# EAGLE design controller (EAGLE 6.5.0)
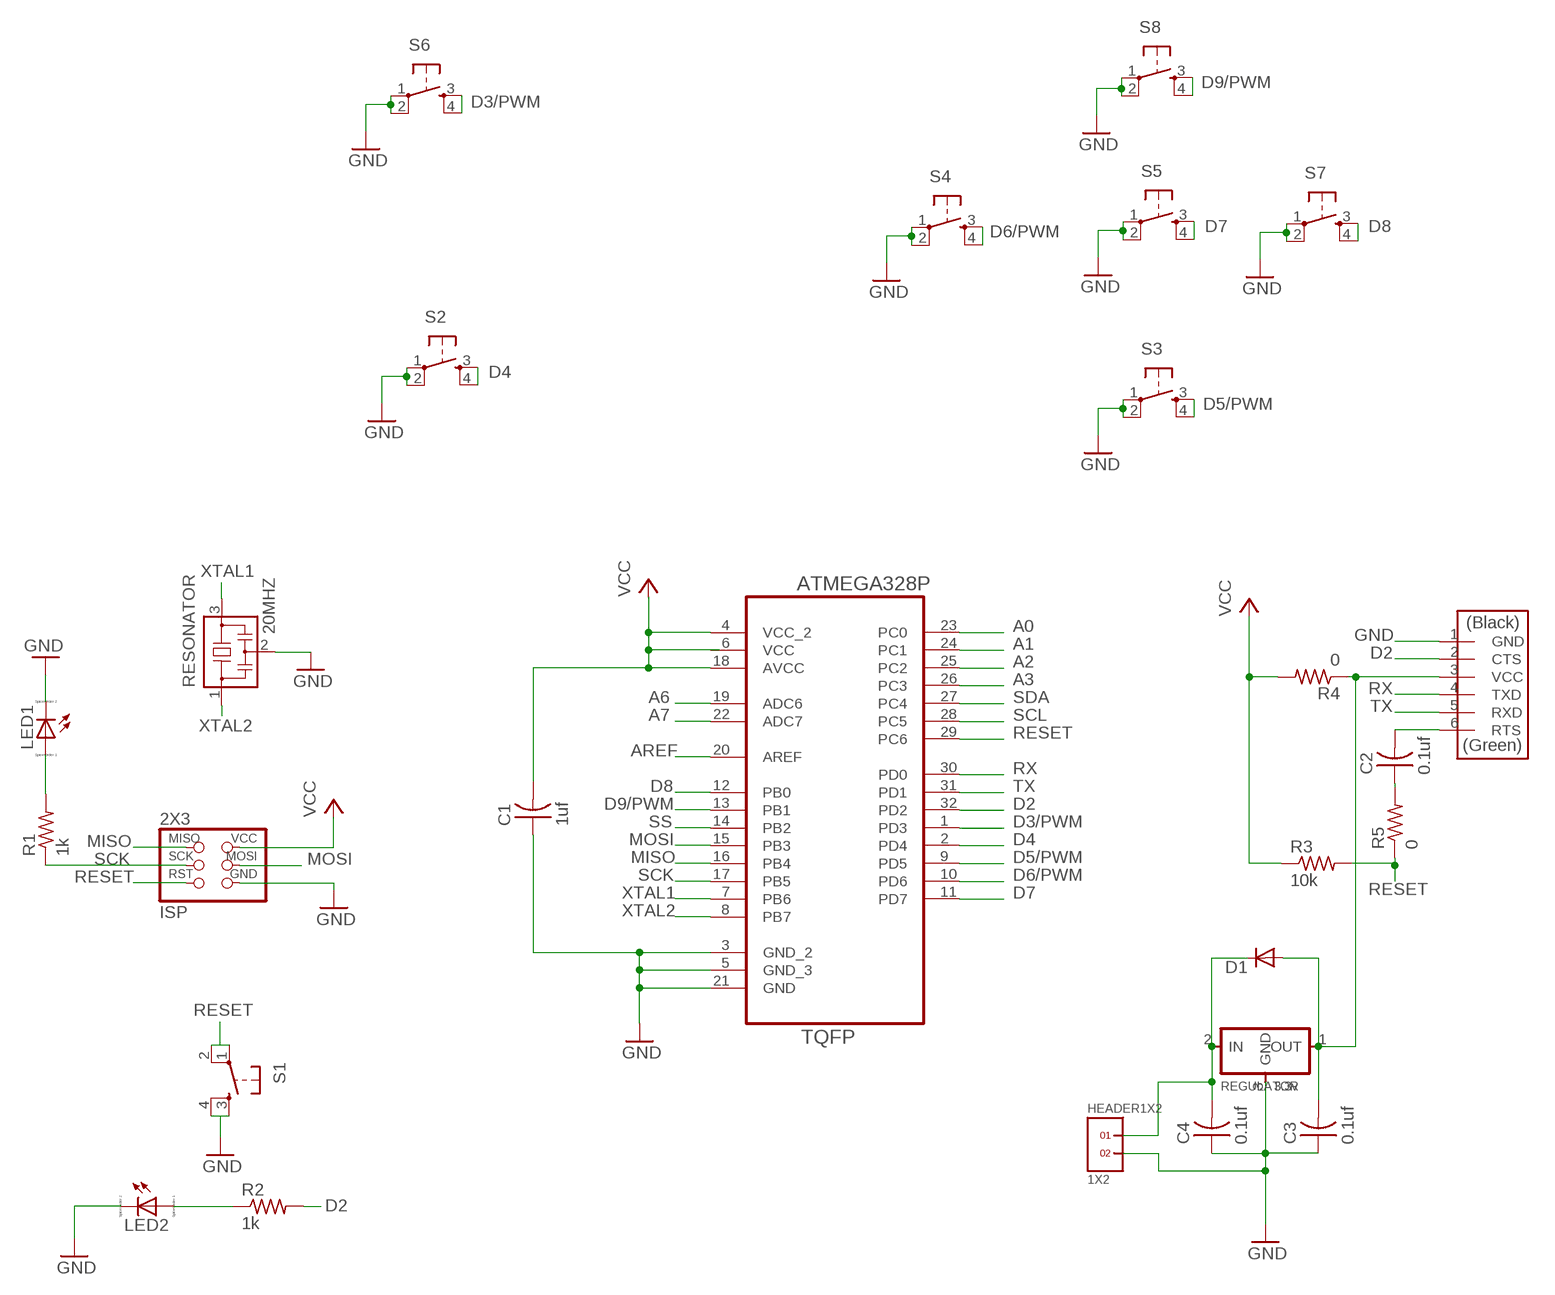
[diagram p0: schematic, sheet 1]

## Parts
2X3  ISP  AVRISPSMD  [2X03SMD]
C1  1uf  CAP-US1206  [C1206]
C2  0.1uf  CAP-US1206  [C1206]
C3  0.1uf  CAP-US1206  [C1206]
C4  0.1uf  CAP-US1206  [C1206]
D1  DIODESOD123  [SOD123]
FTDI  FTDI-SMD-HEADER  [1X06SMD]
HEADER1X2  1X2  [1X2]
LED1  LED_E  [LED_1206]
LED2  LED_E  [LED_1206]
R1  1k  RES-US1206  [R1206]
R2  1k  RES-US1206  [R1206]
R3  10k  RES-US1206  [R1206]
R4  0  RES-US1206  [R1206]
R5  0  RES-US1206  [R1206]
REGULATOR  3.3v  REGULATORSOT23  [SOT23]
RESONATOR  20MHZ  RESONATOR  [EFOBM]
S1  6MM_SWITCH6MM_SWITCH  [6MM_SWITCH]
S2  6MM_SWITCH6MM_SWITCH  [6MM_SWITCH]
S3  6MM_SWITCH6MM_SWITCH  [6MM_SWITCH]
S4  6MM_SWITCH6MM_SWITCH  [6MM_SWITCH]
S5  6MM_SWITCH6MM_SWITCH  [6MM_SWITCH]
S6  6MM_SWITCH6MM_SWITCH  [6MM_SWITCH]
S7  6MM_SWITCH6MM_SWITCH  [6MM_SWITCH]
S8  6MM_SWITCH6MM_SWITCH  [6MM_SWITCH]
U1  ATMEGA328P-AU  [QFP80P900X900X120-32N]

## Nets
A0: U1.23(PC0)
A1: U1.24(PC1)
A2: U1.25(PC2)
A3: U1.26(PC3)
A6: U1.19(ADC6)
A7: U1.22(ADC7)
AREF: U1.20(AREF)
D2: FTDI.2(CTS) R2.2 U1.32(PD2)
D3/PWM: S6.3(S) S6.4(S1) U1.1(PD3)
D4: S2.3(S) S2.4(S1) U1.2(PD4)
D5/PWM: S3.3(S) S3.4(S1) U1.9(PD5)
D6/PWM: S4.3(S) S4.4(S1) U1.10(PD6)
D7: S5.3(S) S5.4(S1) U1.11(PD7)
D8: S7.3(S) S7.4(S1) U1.12(PB0)
D9/PWM: S8.3(S) S8.4(S1) U1.13(PB1)
GND: 2X3.6(GND) C1.1 C3.1 C4.1 FTDI.1(GND) HEADER1X2.2 LED1.C LED2.C REGULATOR.3(GND) RESONATOR.2 S1.3(S) S1.4(S1) S2.1(P) S2.2(P1) S3.1(P) S3.2(P1) S4.1(P) S4.2(P1) S5.1(P) S5.2(P1) S6.1(P) S6.2(P1) S7.1(P) S7.2(P1) S8.1(P) S8.2(P1) U1.3(GND_2) U1.5(GND_3) U1.21(GND)
MISO: 2X3.1(MISO) U1.16(PB4)
MOSI: 2X3.4(MOSI) U1.15(PB3)
N$1: LED1.A R1.2
N$2: LED2.A R2.1
N$7: C2.1 R5.2
N$23: C4.2 D1.CATHODE(C) HEADER1X2.1 REGULATOR.2(IN)
N$29: C3.2 D1.ANODE(A) FTDI.3(VCC) R4.1 REGULATOR.1(OUT)
N$43: C2.2 FTDI.6(RTS)
RESET: 2X3.5(RST) R3.2 R5.1 S1.1(P) S1.2(P1) U1.29(PC6)
RX: FTDI.4(TXD) U1.30(PD0)
SCK: 2X3.3(SCK) R1.1 U1.17(PB5)
SCL: U1.28(PC5)
SDA: U1.27(PC4)
SS: U1.14(PB2)
TX: FTDI.5(RXD) U1.31(PD1)
VCC: 2X3.2(VCC) C1.2 R3.1 R4.2 U1.4(VCC_2) U1.18(AVCC)
XTAL1: RESONATOR.3 U1.7(PB6)
XTAL2: RESONATOR.1 U1.8(PB7)

## Power pins joined to a net without a drawn wire
VCC: U1.6(VCC)

## Library data of the parts
2X3 = fab:AVRISP
C1-C4 = fab:CAP-US
D1 = fab:DIODE: DIODE high speed (Philips)
FTDI = fab:FTDI-SMD-HEADER
HEADER1X2 = headers(2mm):1X2
LED1 LED2 = eagle-ltspice:LED_E: LED Source: http://www.osram.convergy.de Source: www.luxeon.com Source: www.kingbright.com; SPICEMODEL: NONE; SPICEPREFIX: D; SPICETYPE: diode
R1-R5 = fab:RES-US: Resistor (US Symbol) Variants with postfix FAB are widened to allow the routing of internal traces
REGULATOR = fab:REGULATOR
RESONATOR = fab:RESONATOR
S1-S8 = fab:6MM_SWITCH: OMRON SWITCH
U1 = fab:ATMEGA328P-AU; DESCRIPTION: 8-bit Microcontroller with In-System Programmable Flash; MPN: ATMEGA328P-AU; OC_FARNELL: 1715486; OC_NEWARK: 14R4631; PACKAGE: TQFP-32; SUPPLIER: Atmel

## Board
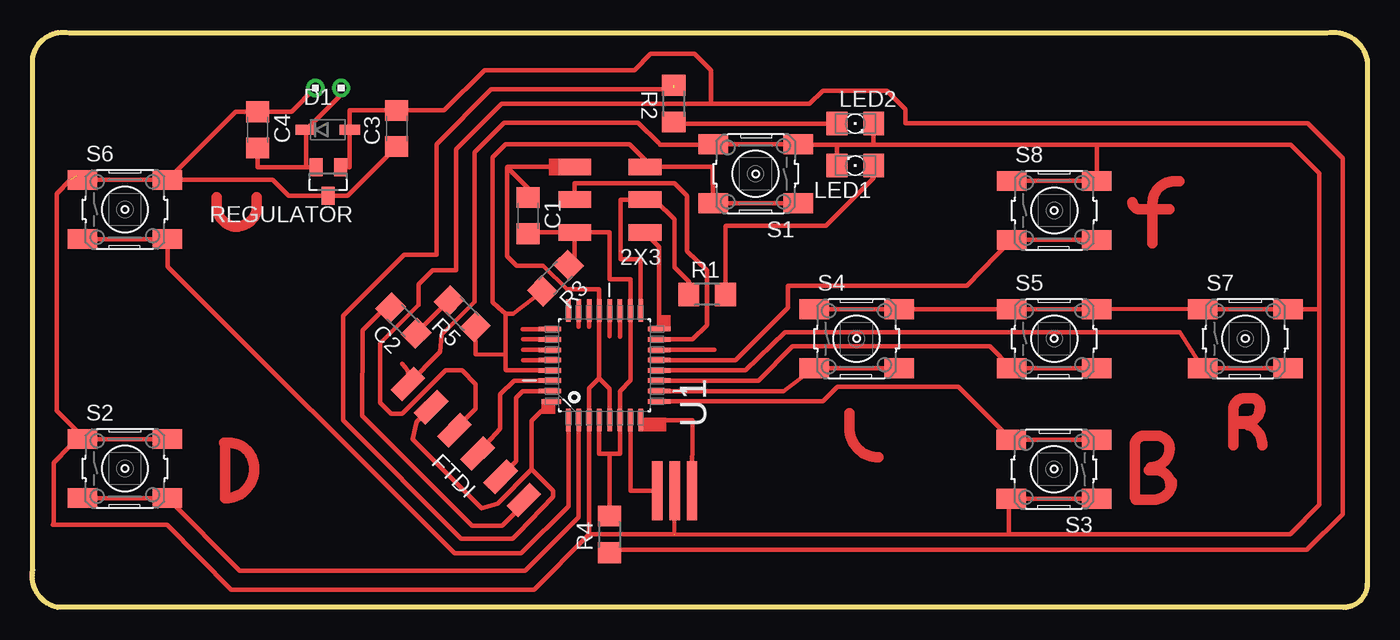
[diagram p1: board, top side]

Size 103.45 x 44.55 mm. Coordinates in mm from the lower left corner, seen from the top.
Outline: 101.62,0 1.96,0 arc-90 0.05,2.91 0.05,42.67 arc-90 2.88,44.5 100.33,44.5 arc-90 103.45,42.38 103.45,1.83 arc-90 101.62,0
Copper layers (1*16): Top 0.035mm / dielectric 1.5mm / Bottom 0.035mm
Design rules "default *": minimum track width 10mil, minimum drill 24mil, track to track 16mil, track to pad 16mil, pad to pad 16mil, via to via 16mil, smd to smd 16mil, copper to edge 40mil, drill to drill 8mil, minimum pad ring 10mil, minimum via ring 8mil, stop-mask expansion 4mil, vias tented up to drill 0mil, thermal gap 10mil

### Footprints (pad centres in the part's own frame; a part is rotated, then mirrored left to right if it is on the bottom)
2X03SMD = smd 2.54 x 1.27: 1 -2.54,2.54; 2 2.92,2.54; 3 -2.54,0; 4 2.92,0; 5 -2.54,-2.54; 6 2.92,-2.54
C1206 = smd 1.6 x 1.8: 1 -1.4,0; 2 1.4,0
SOD123 = smd 1.6 x 0.8: ANODE 1.7,0; CATHODE -1.7,0
1X06SMD = smd 2.54 x 1.27: 1 0,6.35; 2 0,3.81; 3 0,1.27; 4 0,-1.27; 5 0,-3.81; 6 0,-6.35
1X2 = drill 0.8 pad 1.422: 1 -1,0; 2 1,0
LED_1206 = smd 1.6 x 1.803: A -1.422,0; C 1.422,0
R1206 = smd 1.6 x 1.803: 1 -1.422,0; 2 1.422,0
SOT23 = smd 1 x 1.4: 1 -0.95,-1.1; 2 0.95,-1.1; 3 0,1.1
EFOBM = smd 0.8 x 4.572: 1 -1.35,0; 2 0,0; 3 1.35,0
6MM_SWITCH = smd 2.286 x 1.524: 1 -3.302,2.286; 2 3.302,2.286; 3 -3.302,-2.286; 4 3.302,-2.286
QFP80P900X900X120-32N = smd 1.778 x 0.356: 1 -4.242,2.794; 2 -4.242,2.007; 3 -4.242,1.194; 4 -4.242,0.406; 5 -4.242,-0.406; 6 -4.242,-1.194; 7 -4.242,-2.007; 8 -4.242,-2.794; 17 4.242,-2.794; 18 4.242,-2.007; 19 4.242,-1.194; 20 4.242,-0.406; 21 4.242,0.406; 22 4.242,1.194; 23 4.242,2.007; 24 4.242,2.794 | smd 0.356 x 1.778: 9 -2.794,-4.242; 10 -2.007,-4.242; 11 -1.194,-4.242; 12 -0.406,-4.242; 13 0.406,-4.242; 14 1.194,-4.242; 15 2.007,-4.242; 16 2.794,-4.242; 25 2.794,4.242; 26 2.007,4.242; 27 1.194,4.242; 28 0.406,4.242; 29 -0.406,4.242; 30 -1.194,4.242; 31 -2.007,4.242 | smd 0.356 x 1.524: 32 -2.794,4.115

### Placement (x,y rotation side)
2X3  44.96,31.59 180 top
C1  38.43,30.34 270 top
C2  28.75,22.21 135 top
C3  28.24,37.1 90 top
C4  17.47,37 270 top
D1  22.91,37 0 top
FTDI  33.6,12.81 45 top
HEADER1X2  22.93,40.25 180 top
LED1  63.78,34.23 180 top
LED2  63.78,37.48 0 top
R1  52.3,24.24 0 top
R2  49.71,39.03 90.1 top
R3  40.54,25.51 225 top
R4  44.73,5.65 90 top
R5  33.32,22.75 135 top
REGULATOR  22.93,32.98 180 top
RESONATOR  49.78,9.03 180 top
S1  56.06,33.59 180 top
S2  7.19,10.76 0 top
S3  79.17,10.71 180 top
S4  63.88,20.82 0 top
S5  79.19,20.82 0 top
S6  7.19,30.82 0 top
S7  94,20.82 0 top
S8  79.19,30.75 0 top
U1  44.35,18.76 90 top

### Tracks (layer width: path | path; a pad name or v marks a point on that pad's centre or on a via)
D2  (1 unrouted)
  Top 0.356: FTDI.2 29.77,14.37 29.49,13.02 34.82,7.68 36.04,8.04 38.71,10.71 | 49.7,40.25 49.83,40.12 | R2.2 49.37,40.12 35.56,40.12 31.32,35.88 31.32,27.32 28.8,27.32 24.08,22.59 24.08,14.49 33.25,5.32 37.23,5.32 37.69,5.78 40.36,8.57 40.36,9.05 38.71,10.71 | 38.71,10.71 38.71,14.44 U1.32
D3/PWM
  Top 0.356: U1.1 41.55,7.84 37.89,4.18 32.71,4.18 10.49,26.4 S6.4 S6.3
D4
  Top 0.356: U1.2 42.34,6.97 38.2,2.83 16.08,2.83 S2.4 S2.3
D5/PWM
  Top 0.356: S3.3 S3.4 71.75,17.11 62.4,17.11 61.26,15.96 U1.9
D6/PWM
  Top 0.356: U1.10 58.21,16.75 S4.3 S4.4
D7
  Top 0.356: S5.4 S5.3 74.19,20.23 58.92,20.23 56.26,17.56 U1.11
D8
  Top 0.356: U1.12 55.27,18.35 58.34,21.3 88.92,21.3 S7.3 S7.4
D9/PWM
  Top 0.356: S8.4 S8.3 72.41,24.91 58.57,24.91 58.57,23.23 54.51,19.16 U1.13
GND  (2 unrouted)
  Top 0.305: 39.57,26.48 41.45,24.65 | 31.72,21.12 34.29,23.69 | 49.78,5.68 RESONATOR.2 | 49.78,5.65 49.78,5.68 | 49.78,5.68 75.99,5.68
  Top 0.356: 43.94,17.77 U1.21 43.94,24.65 41.45,24.65 | 43.94,17.77 44.75,16.93 U1.5 | 43.94,17.77 43.15,16.98 U1.3 43.15,5.65 | 99.74,23.02 99.74,7.94 97.48,5.68 75.99,5.68 75.66,5.68 75.66,8.42 S3.2 S3.1 | 49.73,5.68 43.15,5.65 | FTDI.1 31.59,19.79 31.72,21.12 | 36.8,34.1 36.8,27.22 37.54,26.48 39.57,26.48 | 36.8,34.1 36.83,34.12 2X3.6 | 36.8,34.1 38.43,32.47 C1.1 | 52.75,35.85 48.66,35.85 48.54,35.98 48.51,35.98 46.94,37.55 36.57,37.55 34.29,35.27 34.29,23.69 | 62.35,35.85 59.33,35.85 59.33,35.83 S1.3 52.78,35.88 52.75,35.85 | 62.35,35.85 65.2,35.85 | 65.2,35.85 82.5,35.85 | 82.5,35.85 97.53,35.85 99.74,33.64 99.74,23.02 | S1.4 52.75,35.85 | 52.75,35.83 52.75,35.85 | LED2.C 65.2,35.85 | LED1.C 62.35,35.85 | S4.1 S4.2 S5.1 S5.2 82.52,23.13 S7.1 S7.2 99.67,23.1 99.74,23.02 | S8.1 S8.2 82.5,35.85 | S2.2 S2.1 | S2.1 2.99,13.04 2.94,13.09 2.94,12.51 1.65,11.21 1.65,6.44 1.6,6.39 10.46,6.39 15.41,1.38 38.88,1.38 43.13,5.63 | S6.2 S6.1 | S6.1 3.76,33.11 3.45,33.41 3.58,33.41 S6.1 | 3.53,13.02 3.86,13.02 S2.1 | 43.15,5.65 43.13,5.63 | 43.13,5.63 43.13,5.65 43.15,5.65 | 2.94,33.11 1.88,32.04 1.88,15.25 3.76,13.37 3.76,13.17 S2.1 | S6.2 15.77,38.4 C4.1 20.08,38.4 HEADER1X2.2 | C3.1 24.43,31.89 REGULATOR.3 | REGULATOR.3 19.86,31.89 18.64,33.11 S6.2 | REGULATOR.3
MISO
  Top 0.356: 2X3.1 48.59,27.95 U1.16
MOSI
  Top 0.356: 2X3.4 42.03,32.85 49.78,32.85 50.75,31.89 50.75,27.6 52.3,26.1 52.3,21.86 51.15,20.77 U1.15
N$1
  Top 0.356: LED1.A 65.2,33.24 61.52,29.55 53.74,29.55 53.72,29.53 R1.2
N$2
  Top 0.356: LED2.A 49.83,37.48 R2.1
N$3
  Top 0.813: 63.32,14.59 63.32,13.88 arc90 65.58,11.62
N$4
  Top 0.813: 88.9,33.01 88.49,33.01 arc90 86.81,31.33 86.81,29.48 86.81,29.43 86.81,28.21
N$6
  Top 0.813: 14.88,12.76 15.03,12.76 | 15.03,12.76 15.21,12.76 arc-90 17.19,10.78 17.19,10.68 arc-90 14.96,8.45 14.96,12.69 arc-90 15.03,12.76
N$7
  Top 0.356: C2.1 31.56,23.04 R5.2
N$8
  Top 0.813: 14.27,31.79 14.27,31.15 arc90 15.95,29.48
N$9
  Top 0.813: 17.4,31.79 17.4,31 arc-90 15.95,29.55
N$10
  Top 0.813: 88.11,30.85 85.8,30.85 arc-90 85.26,31.38
N$11
  Top 0.813: 95.15,15.28 95.15,15.53 arc90 94.46,16.22 94,16.22 arc90 93.06,15.28 93.06,14.41 | 93.06,14.41 93.06,12.56 | 93.06,14.41 94.23,14.41 arc90 95.09,15.28
N$12
  Top 0.813: 93.52,14.24 93.65,14.24 arc-90 95.32,12.56
N$13
  Top 0.813: 86.2,13.3 87.14,13.3 arc-90 88.13,12.31 arc-90 86.69,10.86
N$14
  Top 0.813: 86.15,13.3 arc90 85.44,12.59 85.44,8.52
N$15
  Top 0.813: 85.52,8.34 86.92,8.34 arc90 88.31,9.74
N$16
  Top 0.813: 86.51,10.63 87.07,10.63 arc-90 88.19,9.51
N$17
  Top 0.813: 63.32,14.64 63.32,15.02
N$18
  Top 0.356: 49.37,19.95 52.85,19.95
N$19
  Top 0.356: 44.75,22.37 44.75,20.99
N$20
  Top 0.356: 45.54,22.37 45.54,20.97
N$21
  Top 0.356: 43.15,22.24 43.15,21.73
N$22
  Top 0.356: 42.34,22.29 42.34,21.73
N$23
  Top 0.356: C4.2 17.47,34.08 REGULATOR.2 21.21,34.08 D1.CATHODE 23.93,39.72 HEADER1X2.1
N$24
  Top 0.356: 39.47,21.55 38,21.55
N$25
  Top 0.356: 39.42,20.77 38.05,20.77
N$26
  Top 0.356: 39.42,19.95 38.05,19.95
N$27
  Top 0.356: 39.44,19.16 38.02,19.16
N$28
  Top 0.356: 29.23,17.59 arc45 28.73,18.8 28.67,18.86
N$29
  Top 0.305: 26.97,20.46 29.94,23.43
  Top 0.356: REGULATOR.1 24.61,34.08 D1.ANODE 24.61,38.5 C3.2 31.92,38.49 35.05,41.62 46.66,41.62 47.93,42.89 51.33,42.89 52.6,41.62 52.6,39.03 | FTDI.3 34.36,15.37 34.36,17.29 33.3,18.35 32.03,18.35 28.67,15 27.81,15 26.97,15.84 26.97,20.46 | 44.95,4.46 98.78,4.46 101.55,7.23 101.55,34.78 98.83,37.5 67.66,37.5 67.66,38.57 66.21,40.02 61.26,40.02 60.22,39.03 52.6,39.03 | 44.95,4.46 44.55,4.46 | R4.1 44.95,4.46 | 52.6,39.03 36.37,39.03 32.85,35.51 32.85,26.12 31.04,26.12 29.94,25.03 29.94,23.43
N$43
  Top 0.356: FTDI.6 38.09,8.04 | 38.09,8.04 38.15,8.04 | 38.09,8.04 36.39,6.34 34.08,6.34 25.57,14.85 25.6,21.45 27.04,22.91 | 27.04,22.91 27.58,23.46 | C2.2 27.33,23.2 27.04,22.91
RESET
  Top 0.356: 36.67,22.75 36.67,19.57 | 36.67,19.57 36.67,18.43 36.75,18.35 U1.29 | R3.2 37.26,22.75 36.67,22.75 | R5.1 34.34,19.6 36.67,19.57 | 36.67,22.75 36.08,23.25 35.68,23.65 35.68,34.89 36.67,35.88 46.3,35.88 47.49,34.68 2X3.5 52.73,34.12 S1.2 S1.1
RX
  Top 0.356: FTDI.4 36.27,13.84 36.27,16.5 37.33,17.56 U1.30
SCK
  Top 0.356: U1.17 47.14,26.96 45.59,26.96 45.59,31.59 2X3.3 47.57,31.51 48.31,31.51 49.76,30.06 49.76,26.35 50.87,25.23 R1.1
TX
  Top 0.356: FTDI.5 37.49,11.31 37.49,16.19 37.51,16.27 38,16.75 U1.31
VCC
  Top 0.356: U1.4 43.94,11.9 44.75,11.9 | 44.75,11.9 45.54,11.9 U1.6 45.54,16.73 46.35,17.59 U1.18 46.35,25.41 44.73,25.41 44.73,29.05 2X3.2 | R4.2 44.75,7.1 44.75,11.9 | R3.1 42.03,26.52 2X3.2 | C1.2 38.53,29.05 2X3.2
XTAL1
  Top 0.356: U1.7 46.35,9.03 RESONATOR.3
XTAL2
  Top 0.356: U1.8 51.16,14.52 RESONATOR.1
(copper drawn outside any net)
  shapes: Top area x4

### Text on the board
tValues: C | C | gnd | gnd | C | gnd | gnd | gnd | gnd | gnd | gnd | gnd | gnd